# EAGLE design version1_4 (EAGLE 6.1)

## Sheet 1 of 2
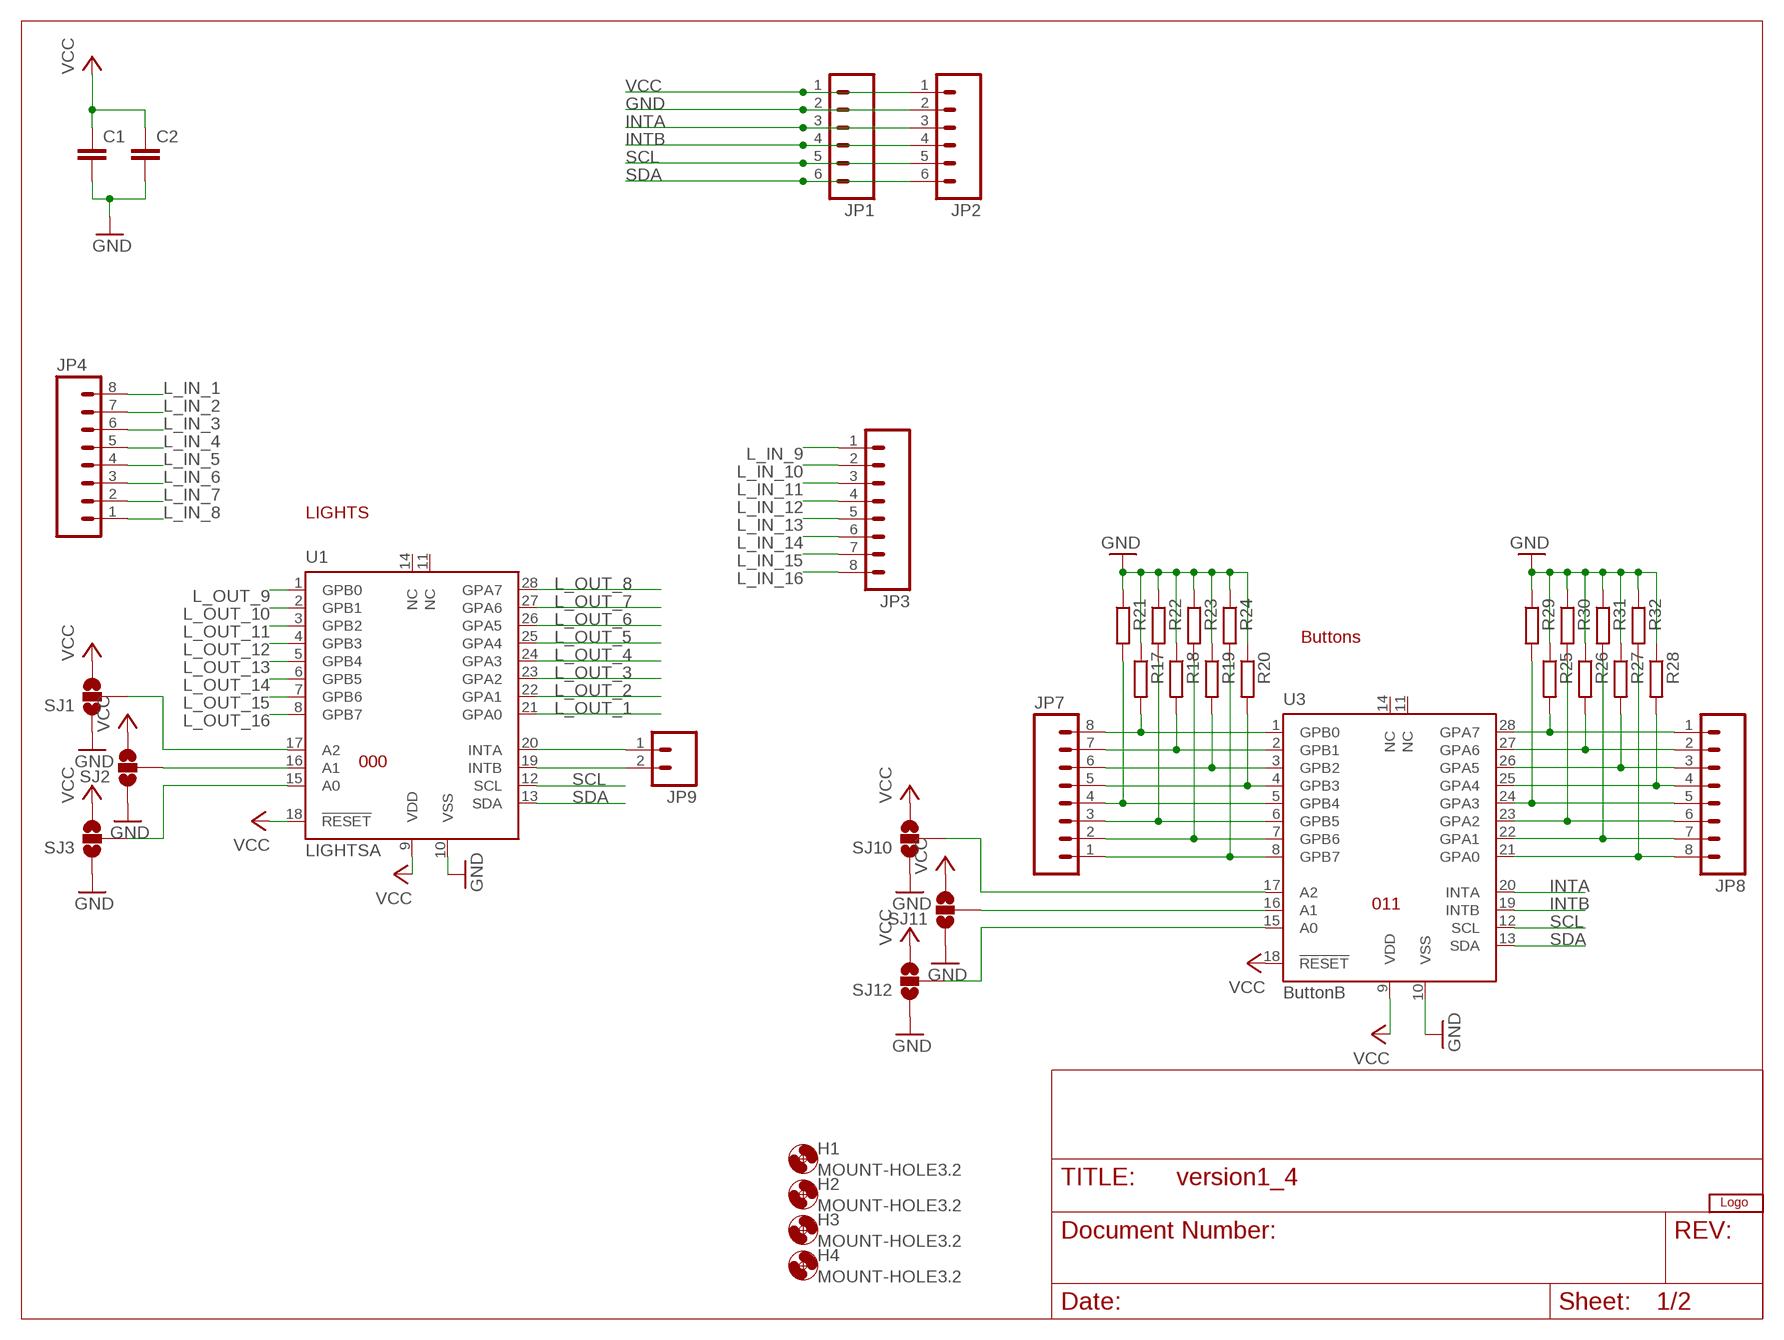
[diagram p0: schematic, sheet 1]

### Parts
C1  C-EUC0805  [C0805]
C2  C-EUC0805  [C0805]
H1  MOUNT-HOLE3.2  [3,2]
H2  MOUNT-HOLE3.2  [3,2]
H3  MOUNT-HOLE3.2  [3,2]
H4  MOUNT-HOLE3.2  [3,2]
JP1  M06LOCK  [1X06_LOCK]
JP2  M06LOCK  [1X06_LOCK]
JP3  M08LOCK  [1X08_LOCK]
JP4  M08LOCK  [1X08_LOCK]
JP7  M08LOCK  [1X08_LOCK]
JP8  M08LOCK  [1X08_LOCK]
JP9  M021X02_NO_SILK  [1X02_NO_SILK]
R17  R-EU_R0805  [R0805]
R18  R-EU_R0805  [R0805]
R19  R-EU_R0805  [R0805]
R20  R-EU_R0805  [R0805]
R21  R-EU_R0805  [R0805]
R22  R-EU_R0805  [R0805]
R23  R-EU_R0805  [R0805]
R24  R-EU_R0805  [R0805]
R25  R-EU_R0805  [R0805]
R26  R-EU_R0805  [R0805]
R27  R-EU_R0805  [R0805]
R28  R-EU_R0805  [R0805]
R29  R-EU_R0805  [R0805]
R30  R-EU_R0805  [R0805]
R31  R-EU_R0805  [R0805]
R32  R-EU_R0805  [R0805]
SJ1  SOLDERJUMPER_2WAY-OLDS  [SJ_3]
SJ2  SOLDERJUMPER_2WAY-OLDS  [SJ_3]
SJ3  SOLDERJUMPER_2WAY-OLDS  [SJ_3]
SJ10  SOLDERJUMPER_2WAY-OLDS  [SJ_3]
SJ11  SOLDERJUMPER_2WAY-OLDS  [SJ_3]
SJ12  SOLDERJUMPER_2WAY-OLDS  [SJ_3]
U1  LIGHTSA  MCP23017A  [MCP23017A]
U3  ButtonB  MCP23017A  [MCP23017A]
U$1  BUNNYLOGOCALVIN2  [CALVIN2]

### Nets
GND: C1.2 C2.2 JP1.2 JP2.2 R17.1 R18.1 R19.1 R20.1 R21.1 R22.1 R23.1 R24.1 R25.1 R26.1 R27.1 R28.1 R29.1 R30.1 R31.1 R32.1 SJ1.1 SJ2.1 SJ3.1 SJ10.1 SJ11.1 SJ12.1 U1.10(VSS) U3.10(VSS) ; also sheet 2
INTA: JP1.3 JP2.3 U3.20(INTA)
INTB: JP1.4 JP2.4 U3.19(INTB)
L_IN_1: JP4.8 ; also sheet 2
L_IN_2: JP4.7 ; also sheet 2
L_IN_3: JP4.6 ; also sheet 2
L_IN_4: JP4.5 ; also sheet 2
L_IN_5: JP4.4 ; also sheet 2
L_IN_6: JP4.3 ; also sheet 2
L_IN_7: JP4.2 ; also sheet 2
L_IN_8: JP4.1 ; also sheet 2
L_IN_9: JP3.1 ; also sheet 2
L_IN_10: JP3.2 ; also sheet 2
L_IN_11: JP3.3 ; also sheet 2
L_IN_12: JP3.4 ; also sheet 2
L_IN_13: JP3.5 ; also sheet 2
L_IN_14: JP3.6 ; also sheet 2
L_IN_15: JP3.7 ; also sheet 2
L_IN_16: JP3.8 ; also sheet 2
L_OUT_1: U1.21(GPA0) ; also sheet 2
L_OUT_2: U1.22(GPA1) ; also sheet 2
L_OUT_3: U1.23(GPA2) ; also sheet 2
L_OUT_4: U1.24(GPA3) ; also sheet 2
L_OUT_5: U1.25(GPA4) ; also sheet 2
L_OUT_6: U1.26(GPA5) ; also sheet 2
L_OUT_7: U1.27(GPA6) ; also sheet 2
L_OUT_8: U1.28(GPA7) ; also sheet 2
L_OUT_9: U1.1(GPB0) ; also sheet 2
L_OUT_10: U1.2(GPB1) ; also sheet 2
L_OUT_11: U1.3(GPB2) ; also sheet 2
L_OUT_12: U1.4(GPB3) ; also sheet 2
L_OUT_13: U1.5(GPB4) ; also sheet 2
L_OUT_14: U1.6(GPB5) ; also sheet 2
L_OUT_15: U1.7(GPB6) ; also sheet 2
L_OUT_16: U1.8(GPB7) ; also sheet 2
N$49: JP7.1 R24.2 U3.8(GPB7)
N$50: JP7.2 R23.2 U3.7(GPB6)
N$51: JP7.3 R22.2 U3.6(GPB5)
N$52: JP7.4 R21.2 U3.5(GPB4)
N$53: JP7.5 R20.2 U3.4(GPB3)
N$54: JP7.6 R19.2 U3.3(GPB2)
N$55: JP7.7 R18.2 U3.2(GPB1)
N$56: JP7.8 R17.2 U3.1(GPB0)
N$57: JP8.1 R25.2 U3.28(GPA7)
N$58: JP8.2 R26.2 U3.27(GPA6)
N$59: JP8.3 R27.2 U3.26(GPA5)
N$60: JP8.4 R28.2 U3.25(GPA4)
N$61: JP8.5 R29.2 U3.24(GPA3)
N$62: JP8.6 R30.2 U3.23(GPA2)
N$63: JP8.7 R31.2 U3.22(GPA1)
N$64: JP8.8 R32.2 U3.21(GPA0)
N$69: JP9.1 U1.20(INTA)
N$70: JP9.2 U1.19(INTB)
N$74: SJ10.2 U3.17(A2)
N$75: SJ11.2 U3.16(A1)
N$76: SJ12.2 U3.15(A0)
N$77: SJ2.2 U1.16(A1)
N$78: SJ3.2 U1.15(A0)
N$79: SJ1.2 U1.17(A2)
SCL: JP1.5 JP2.5 U1.12(SCL) U3.12(SCL)
SDA: JP1.6 JP2.6 U1.13(SDA) U3.13(SDA)
VCC [power]: C1.1 C2.1 JP1.1 JP2.1 SJ1.3 SJ2.3 SJ3.3 SJ10.3 SJ11.3 SJ12.3 U1.9(VDD) U1.18(!RESET) U3.9(VDD) U3.18(!RESET)
Unconnected: U1.11(NC) U1.14(NC) U3.11(NC) U3.14(NC)

### Notes on the sheet
- LIGHTS
- Buttons
- 000
- 011

## Sheet 2 of 2
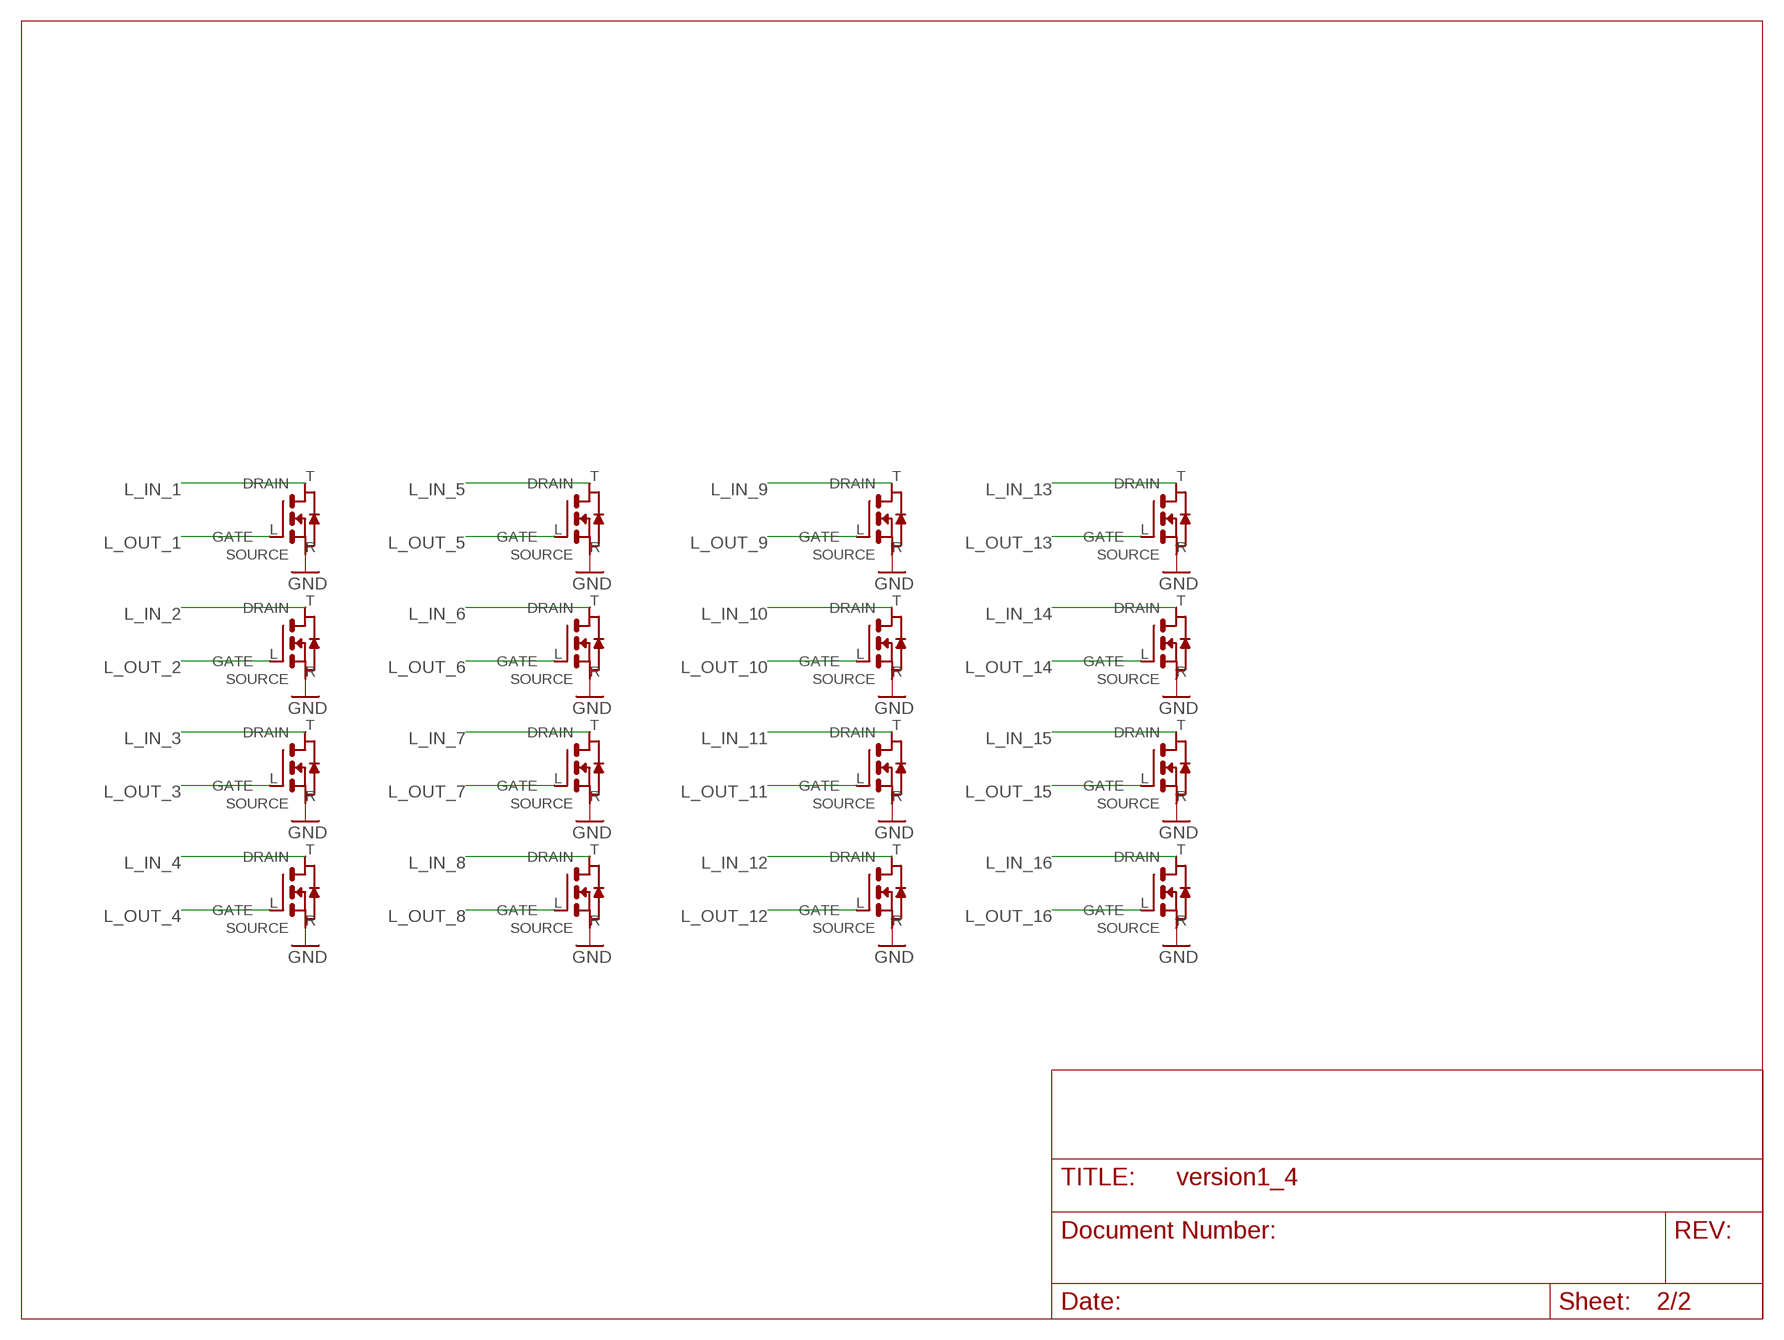
[diagram p1: schematic, sheet 2]

### Parts
Q1  DMG2302U  [SOT23-3A]
Q2  DMG2302U  [SOT23-3A]
Q3  DMG2302U  [SOT23-3A]
Q4  DMG2302U  [SOT23-3A]
Q5  DMG2302U  [SOT23-3A]
Q6  DMG2302U  [SOT23-3A]
Q7  DMG2302U  [SOT23-3A]
Q8  DMG2302U  [SOT23-3A]
Q9  DMG2302U  [SOT23-3A]
Q10  DMG2302U  [SOT23-3A]
Q11  DMG2302U  [SOT23-3A]
Q12  DMG2302U  [SOT23-3A]
Q13  DMG2302U  [SOT23-3A]
Q14  DMG2302U  [SOT23-3A]
Q15  DMG2302U  [SOT23-3A]
Q16  DMG2302U  [SOT23-3A]

### Nets
GND: Q1.R(SOURCE) Q2.R(SOURCE) Q3.R(SOURCE) Q4.R(SOURCE) Q5.R(SOURCE) Q6.R(SOURCE) Q7.R(SOURCE) Q8.R(SOURCE) Q9.R(SOURCE) Q10.R(SOURCE) Q11.R(SOURCE) Q12.R(SOURCE) Q13.R(SOURCE) Q14.R(SOURCE) Q15.R(SOURCE) Q16.R(SOURCE) ; also sheet 1
L_IN_1: Q2.T(DRAIN) ; also sheet 1
L_IN_2: Q1.T(DRAIN) ; also sheet 1
L_IN_3: Q3.T(DRAIN) ; also sheet 1
L_IN_4: Q4.T(DRAIN) ; also sheet 1
L_IN_5: Q5.T(DRAIN) ; also sheet 1
L_IN_6: Q6.T(DRAIN) ; also sheet 1
L_IN_7: Q7.T(DRAIN) ; also sheet 1
L_IN_8: Q8.T(DRAIN) ; also sheet 1
L_IN_9: Q9.T(DRAIN) ; also sheet 1
L_IN_10: Q10.T(DRAIN) ; also sheet 1
L_IN_11: Q11.T(DRAIN) ; also sheet 1
L_IN_12: Q12.T(DRAIN) ; also sheet 1
L_IN_13: Q13.T(DRAIN) ; also sheet 1
L_IN_14: Q14.T(DRAIN) ; also sheet 1
L_IN_15: Q15.T(DRAIN) ; also sheet 1
L_IN_16: Q16.T(DRAIN) ; also sheet 1
L_OUT_1: Q2.L(GATE) ; also sheet 1
L_OUT_2: Q1.L(GATE) ; also sheet 1
L_OUT_3: Q3.L(GATE) ; also sheet 1
L_OUT_4: Q4.L(GATE) ; also sheet 1
L_OUT_5: Q5.L(GATE) ; also sheet 1
L_OUT_6: Q6.L(GATE) ; also sheet 1
L_OUT_7: Q7.L(GATE) ; also sheet 1
L_OUT_8: Q8.L(GATE) ; also sheet 1
L_OUT_9: Q9.L(GATE) ; also sheet 1
L_OUT_10: Q10.L(GATE) ; also sheet 1
L_OUT_11: Q11.L(GATE) ; also sheet 1
L_OUT_12: Q12.L(GATE) ; also sheet 1
L_OUT_13: Q13.L(GATE) ; also sheet 1
L_OUT_14: Q14.L(GATE) ; also sheet 1
L_OUT_15: Q15.L(GATE) ; also sheet 1
L_OUT_16: Q16.L(GATE) ; also sheet 1

## Library data of the parts
C1 C2 = rcl:C-EU: CAPACITOR, European symbol
H1-H4 = holes:MOUNT-HOLE: MOUNTING HOLE with drill center marker
JP1 JP2 = SparkFun:M06: Header 6 Standard 6-pin 0.1" header. Use with straight break away headers (SKU : PRT-00116), right angle break away headers (PRT-00553), swiss pins (PRT-00743), machine pins (PRT-00117), and female headers (PRT-00115). Molex polarized connector foot print use with SKU : PRT-08094 with associated crimp pins and housings. NOTES ON THE VARIANTS LOCK and LOCK_LONGPADS... This footprint was designed to help hold the alignment of a through-hole component (i.e. 6-pin header) while soldering it into place. You may notice that each hole has been shifted either up or down by 0.005 of an inch from it's more standard position (which is a perfectly straight line). This slight alteration caused the pins (the squares in the middle) to touch the edges of the holes. Because they are alternating, it causes a "brace" to hold the component in place. 0.005 has proven to be the perfect amount of "off-center" position when using our standard breakaway headers. Although looks a little odd when you look at the bare footprint, once you have a header in there, the alteration is very hard to notice. Also, if you push a header all the way into place, it is covered up entirely on the bottom side. This idea of altering the position of holes to aid alignment will be further integrated into the Sparkfun Library for other footprints. It can help hold any component with 3 or more connection pins.
JP3 JP4 JP7 JP8 = SparkFun:M08: Header 8 Standard 8-pin 0.1" header. Use with straight break away headers (SKU : PRT-00116), right angle break away headers (PRT-00553), swiss pins (PRT-00743), machine pins (PRT-00117), and female headers (PRT-00115).
JP9 = SparkFun:M02: Header 2 Standard 2-pin 0.1" header. Use with straight break away headers (SKU : PRT-00116), right angle break away headers (PRT-00553), swiss pins (PRT-00743), machine pins (PRT-00117), and female headers (PRT-00115). Molex polarized connector foot print use with SKU : PRT-08233 with associated crimp pins and housings.
Q1-Q16 = brv_v6_2:DMG2302U
R17-R32 = rcl:R-EU_: RESISTOR, European symbol
SJ1-SJ3 SJ10-SJ12 = SparkFun:SOLDERJUMPER_2WAY-OLD: Solder Jumper 2 way solder jumper
U1 U3 = brv_v6_2:MCP23017A: edit this description Auto generated by make-symbol-device-package-bsdl.ulp Rev. 43 Source:
U$1 = brv_v6_2:BUNNYLOGO

## Net classes
0 default: width 0.203 mm, drill 0.305 mm, clearance 0.203 mm
1 power: width 0.203 mm, drill 0.305 mm, clearance 0.203 mm

## Board
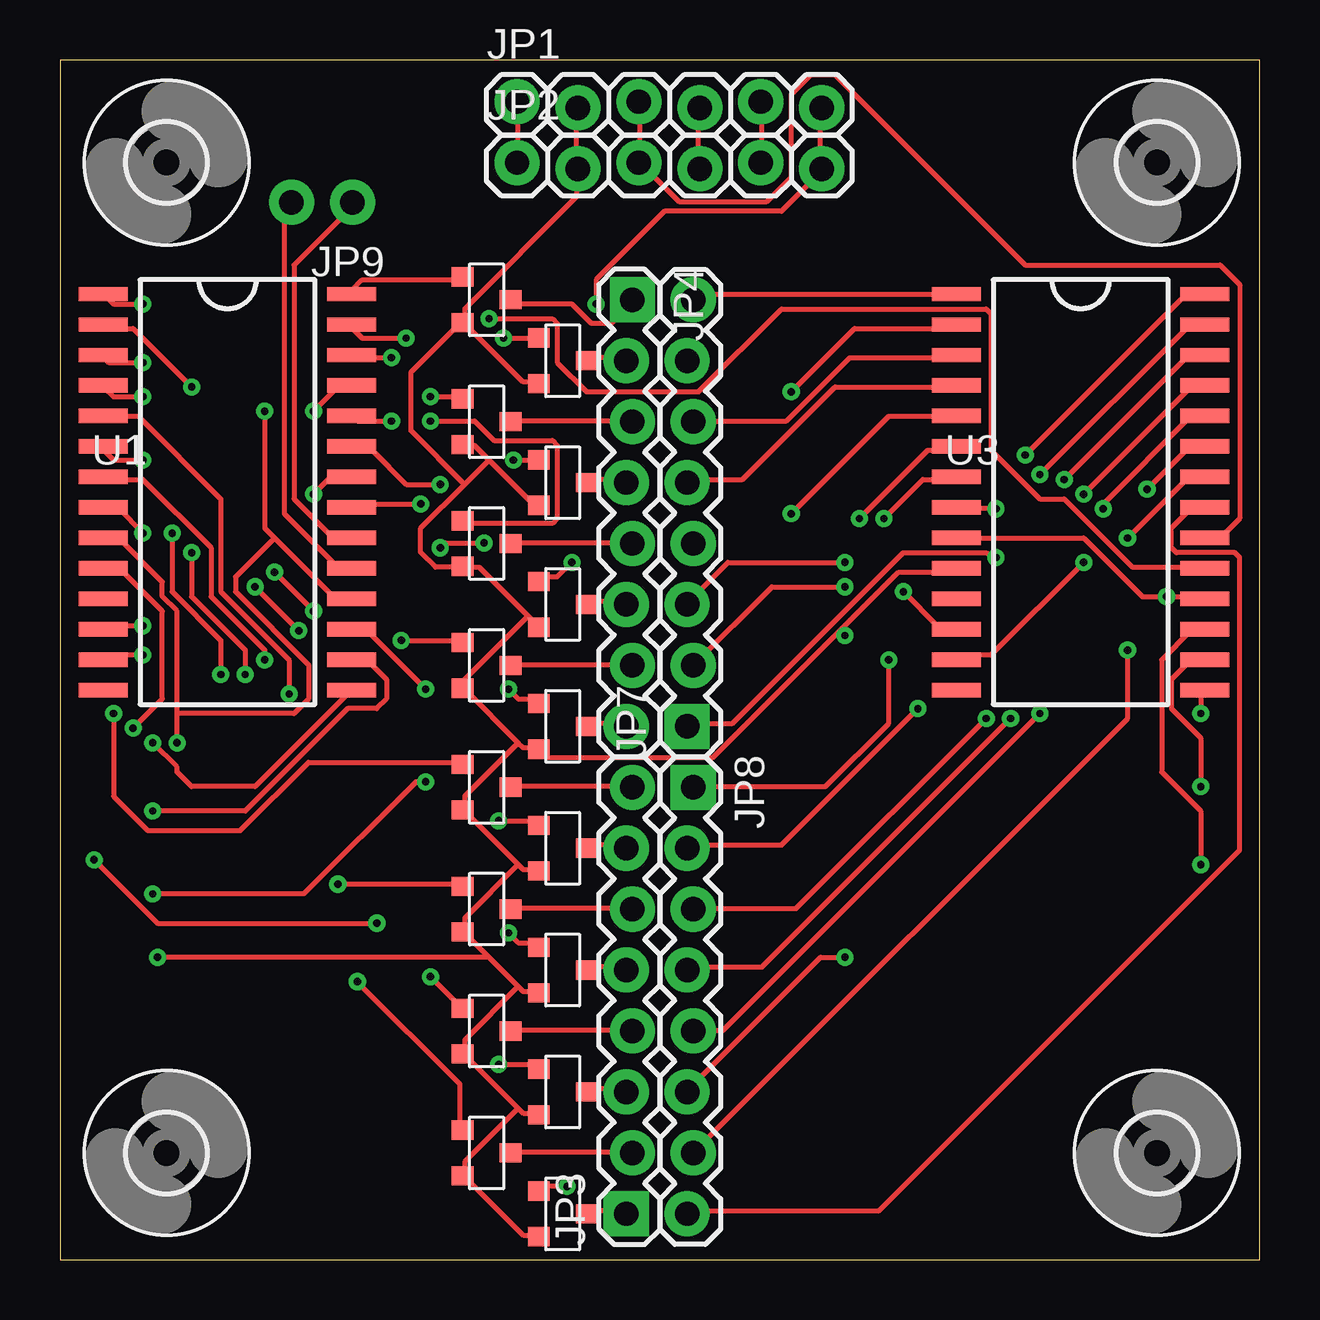
[diagram p2: board, top side]
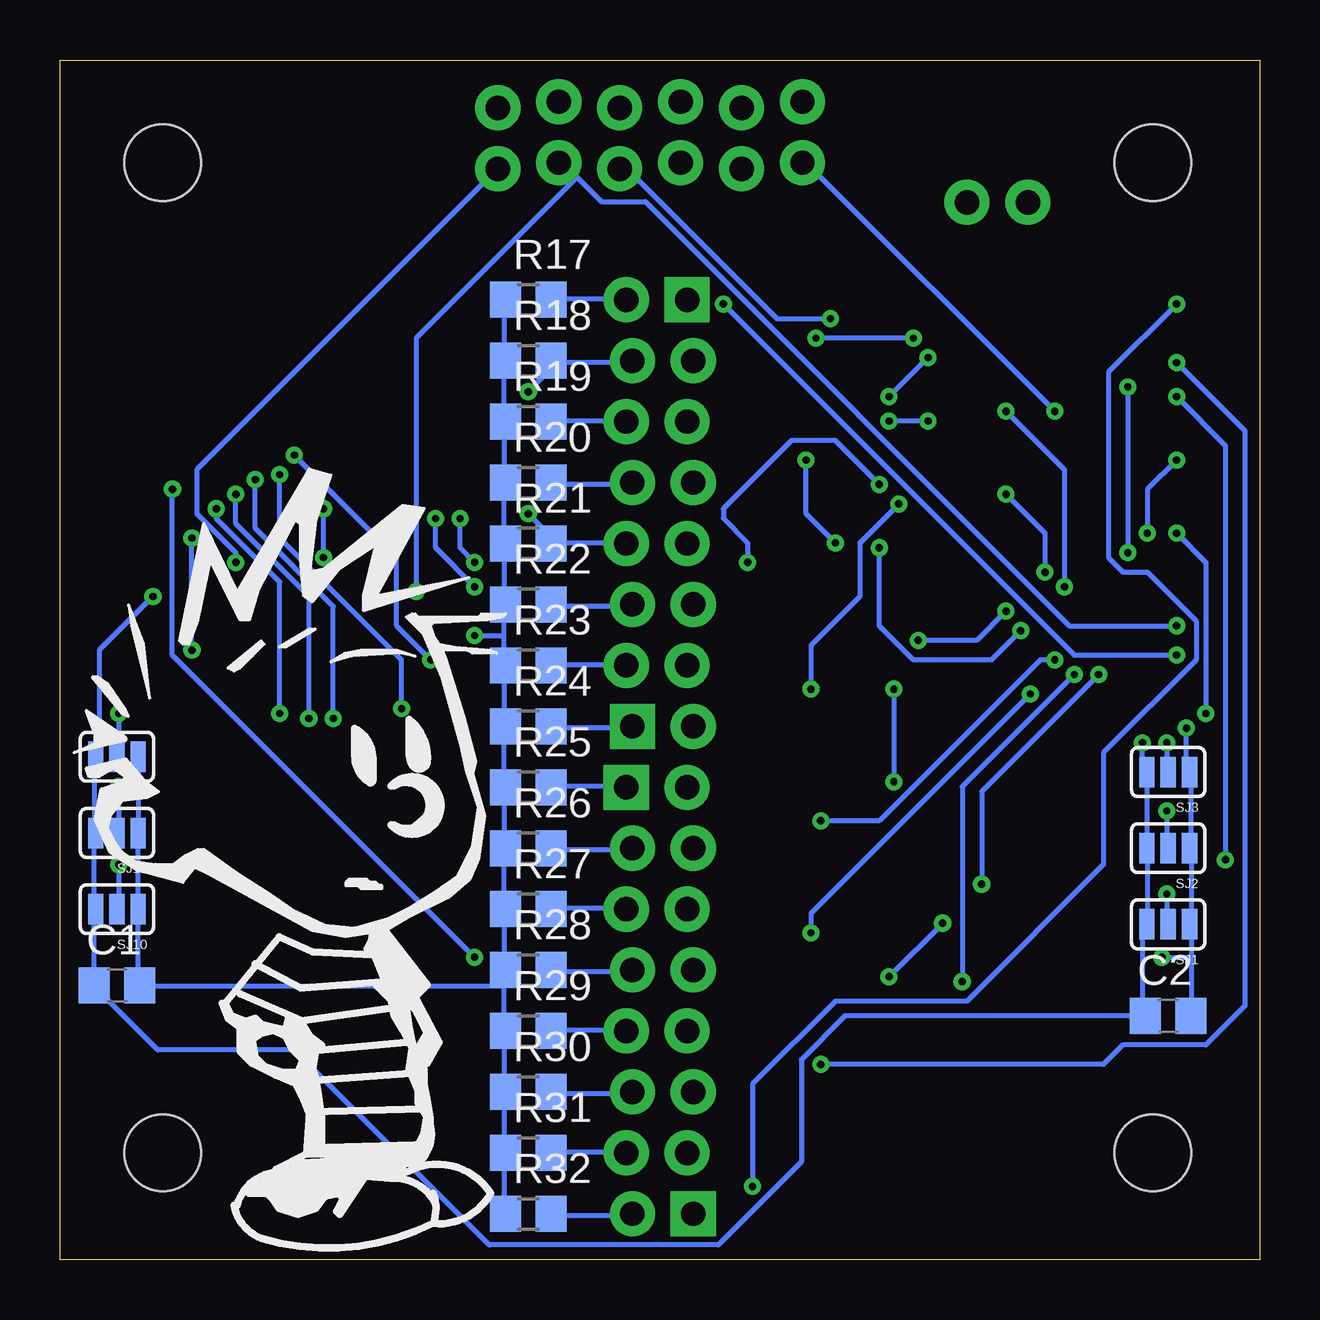
[diagram p3: board, bottom side, seen from below]

Size 50 x 50 mm. Coordinates in mm from the lower left corner, seen from the top.
Outline: 50,0 50,50 0,50 0,0 50,0
Copper layers (1*16): Top 0.035mm / dielectric 1.5mm / Bottom 0.035mm
Design rules: minimum track width 8mil, minimum drill 12mil, track to track 8mil, track to pad 8mil, pad to pad 8mil, via to via 8mil, smd to smd 8mil, copper to edge 20mil, drill to drill 8mil, minimum pad ring 10mil, minimum via ring 8mil, stop-mask expansion 4mil, vias tented up to drill 0mil, thermal gap 10mil

### Footprints (pad centres in the part's own frame; a part is rotated, then mirrored left to right if it is on the bottom)
C0805 = smd 1.3 x 1.5: 1 -0.95,0; 2 0.95,0
3,2 = hole 3.2: 0,0
1X06_LOCK = drill 1.016 pad 1.88: 1 0,0; 2 2.54,-0.254; 3 5.08,0; 4 7.62,-0.254; 5 10.16,0; 6 12.7,-0.254
1X08_LOCK = drill 1.016 pad 1.88 square: 1 0,0.127 | drill 1.016 pad 1.88: 2 2.54,-0.127; 3 5.08,0.127; 4 7.62,-0.127; 5 10.16,0.127; 6 12.7,-0.127; 7 15.24,0.127; 8 17.78,-0.127
1X02_NO_SILK = drill 1.016 pad 1.88: 1 0,0; 2 2.54,0
SOT23-3A = smd 0.8 x 0.9: L -0.95,-1; R 0.95,-1; T 0,1
R0805 = smd 1.3 x 1.5: 1 -0.95,0; 2 0.95,0
SJ_3 = smd 0.635 x 1.27: 1 -0.889,0; 2 0,0; 3 0.889,0
MCP23017A = smd 2.05 x 0.6: 1 -5.177,8.255; 2 -5.177,6.985; 3 -5.177,5.715; 4 -5.177,4.445; 5 -5.177,3.175; 6 -5.177,1.905; 7 -5.177,0.635; 8 -5.177,-0.635; 9 -5.177,-1.905; 10 -5.177,-3.175; 11 -5.177,-4.445; 12 -5.177,-5.715; 13 -5.177,-6.985; 14 -5.177,-8.255; 15 5.177,-8.255; 16 5.177,-6.985; 17 5.177,-5.715; 18 5.177,-4.445; 19 5.177,-3.175; 20 5.177,-1.905; 21 5.177,-0.635; 22 5.177,0.635; 23 5.177,1.905; 24 5.177,3.175; 25 5.177,4.445; 26 5.177,5.715; 27 5.177,6.985; 28 5.177,8.255

### Placement (x,y rotation side)
C1  47.62,11.43 0 bottom
C2  3.81,10.16 0 bottom
H1  45.72,4.45 0 top
H2  45.72,45.72 0 top
H3  4.45,45.72 0 top
H4  4.45,4.45 0 top
JP1  19.05,48.26 0 top
JP2  19.05,45.72 0 top
JP3  23.73,1.91 90 top
JP4  23.73,40.01 270 top
JP7  26.27,22.23 90 top
JP8  26.27,19.68 270 top
JP9  12.19,44.07 180 top
Q1  17.78,24.77 270 top
Q2  20.95,22.23 270 top
Q3  20.95,27.3 270 top
Q4  17.78,29.84 270 top
Q5  20.95,32.38 270 top
Q6  17.78,34.92 270 top
Q7  20.95,37.47 270 top
Q8  17.78,40.01 270 top
Q9  20.95,1.91 270 top
Q10  17.78,4.45 270 top
Q11  20.95,6.99 270 top
Q12  17.78,9.53 270 top
Q13  20.95,12.06 270 top
Q14  17.78,14.61 270 top
Q15  20.95,17.14 270 top
Q16  17.78,19.68 270 top
R17  30.48,40.01 0 bottom
R18  30.48,37.47 0 bottom
R19  30.48,34.92 0 bottom
R20  30.48,32.38 0 bottom
R21  30.48,29.84 0 bottom
R22  30.48,27.3 0 bottom
R23  30.48,24.77 0 bottom
R24  30.48,22.23 0 bottom
R25  30.48,19.68 0 bottom
R26  30.48,17.14 0 bottom
R27  30.48,14.61 0 bottom
R28  30.48,12.06 0 bottom
R29  30.48,9.53 0 bottom
R30  30.48,6.99 0 bottom
R31  30.48,4.45 0 bottom
R32  30.48,1.91 0 bottom
SJ1  3.81,13.97 180 bottom
SJ2  3.81,17.14 180 bottom
SJ3  3.81,20.32 180 bottom
SJ10  47.62,14.61 180 bottom
SJ11  47.62,17.78 180 bottom
SJ12  47.62,20.95 180 bottom
U1  6.99,31.98 0 top
U3  42.55,31.98 0 top
U$1  50.04,-0.51 0 bottom

### Tracks (layer width: path | path; a pad name or v marks a point on that pad's centre or on a via)
GND  (via drill 0.3)
  Top 0.203: v3.05,22.15 4.27,23.37 4.27,27.03 2.64,28.65 1.83,28.65 U1.10 | Q9.R 19.91,1.02 19.3,1.02 16.87,3.45 Q10.R 16.87,3.66 16.87,4.06 19.1,6.3 | 19.1,6.3 16.87,8.53 Q12.R 16.87,8.74 16.87,9.14 19.1,11.38 | 19.1,6.3 19.3,6.1 19.91,6.1 Q11.R | 17.88,12.6 16.87,13.61 Q14.R 16.87,13.82 16.87,14.22 19.1,16.46 | 17.88,12.6 19.1,11.38 | 19.1,11.38 19.3,11.18 19.91,11.18 Q13.R | 19.1,16.46 16.87,18.69 Q16.R 16.87,18.9 16.87,19.3 19.1,21.54 | 19.1,16.46 19.3,16.26 19.91,16.26 Q15.R | Q8.R 16.87,39.01 19.3,36.58 19.91,36.58 Q7.R | Q8.R 16.87,39.22 16.87,39.62 21.54,44.3 21.54,45.31 JP2.2 21.54,45.52 21.54,47.95 JP1.2 | 17.88,33.33 19.91,31.29 Q5.R | 17.88,33.33 17.27,33.93 16.87,33.93 Q6.R | 19.51,26.82 17.48,28.85 16.87,28.85 Q4.R 16.66,28.85 15.65,28.85 15.04,29.46 15.04,30.48 16.87,32.31 | 19.51,26.82 19.91,26.42 Q3.R | 19.1,21.54 16.87,23.77 Q1.R 16.66,23.98 19.51,26.82 | 19.1,21.54 19.3,21.34 19.91,21.34 Q2.R 20.12,21.13 20.32,20.93 27.23,20.93 32.51,26.21 | 32.51,26.21 34.95,28.65 37.19,28.65 U3.10 | 16.87,32.31 17.88,33.33 | 16.87,32.31 14.63,34.54 14.63,36.98 16.66,39.01 Q8.R | 17.88,12.6 v4.06,12.6 | 32.51,26.21 v32.72,26.01
  Bottom 0.203: SJ12.1 46.74,20.93 46.74,17.88 SJ11.1 46.74,17.68 46.74,14.63 SJ10.1 46.74,14.43 46.74,11.58 C1.2 46.53,11.38 31.5,11.38 | R17.1 31.5,39.83 31.5,37.59 R18.1 31.5,37.39 31.5,34.95 R19.1 31.5,34.75 31.5,32.51 R20.1 31.5,32.31 31.5,29.87 R21.1 31.5,29.67 31.5,27.43 R22.1 31.5,27.23 31.5,26.01 | R28.1 31.5,12.19 31.5,14.43 R27.1 31.5,14.63 31.5,17.07 R26.1 31.5,17.27 31.5,19.51 R25.1 31.5,19.71 31.5,22.15 R24.1 31.5,22.35 31.5,24.59 R23.1 31.5,24.79 31.5,26.01 | R32.1 31.5,2.03 31.5,4.27 R31.1 31.5,4.47 31.5,6.91 R30.1 31.5,7.11 31.5,9.35 R29.1 31.5,9.55 31.5,11.38 | 31.5,11.38 31.5,11.99 R28.1 | 31.5,11.38 R28.1 | 2.85,12.6 2.85,13.82 SJ1.1 2.85,14.02 2.85,17.07 SJ2.1 2.85,17.27 2.85,20.32 SJ3.1 3.05,20.32 v3.05,22.15 | 2.85,12.6 2.85,10.16 C2.2 | v4.06,12.6 2.85,12.6 | v32.72,26.01 31.5,26.01
INTA
  Top 0.203: 24.18,45.72 25.81,44.09 29.46,44.09 30.48,45.11 30.48,48.56 31.29,49.38 32.31,49.38 40.23,41.45 48.36,41.45 49.17,40.64 49.17,30.89 48.56,30.28 47.75,30.28 U3.20 | 24.18,45.72 JP2.3 24.18,45.72 | 24.18,45.72 24.18,48.16 JP1.3
INTB  (via drill 0.3)
  Top 0.203: v17.88,39.22 20.52,39.22 20.73,39.01 20.73,37.39 21.95,36.17 26.62,36.17 30.07,39.62 38.61,39.62 38.81,39.42 38.81,33.73 40.84,31.7 41.86,31.7 44.7,28.85 47.55,28.85 U3.19 | JP1.4 26.62,47.95 26.62,45.52 JP2.4
  Bottom 0.203: v17.88,39.22 20.12,39.22 26.21,45.31 26.62,45.31 JP2.4
L_IN_1
  Top 0.203: Q2.T 22.15,22.35 23.57,22.35 JP4.8
L_IN_2
  Top 0.203: Q1.T 18.9,24.79 23.77,24.79 JP4.7
L_IN_3
  Top 0.203: Q3.T 22.15,27.43 23.57,27.43 JP4.6
L_IN_4
  Top 0.203: Q4.T 18.9,29.87 23.77,29.87 JP4.5
L_IN_5
  Top 0.203: Q5.T 22.15,32.51 23.57,32.51 JP4.4
L_IN_6
  Top 0.203: Q6.T 18.9,34.95 23.77,34.95 JP4.3
L_IN_7
  Top 0.203: Q7.T 22.15,37.59 23.57,37.59 JP4.2
L_IN_8
  Top 0.203: Q8.T 18.9,39.83 21.34,39.83 22.15,39.01 22.96,39.01 23.77,39.83 JP4.1
L_IN_9
  Top 0.203: Q9.T 22.15,2.03 23.57,2.03 JP3.1
L_IN_10
  Top 0.203: Q10.T 18.9,4.47 23.77,4.47 JP3.2
L_IN_11
  Top 0.203: Q11.T 22.15,7.11 23.57,7.11 JP3.3
L_IN_12
  Top 0.203: Q12.T 18.9,9.55 23.77,9.55 JP3.4
L_IN_13
  Top 0.203: Q13.T 22.15,12.19 23.57,12.19 JP3.5
L_IN_14
  Top 0.203: Q14.T 18.9,14.63 23.77,14.63 JP3.6
L_IN_15
  Top 0.203: Q15.T 22.15,17.27 23.57,17.27 JP3.7
L_IN_16
  Top 0.203: Q16.T 18.9,19.71 23.77,19.71 JP3.8
L_OUT_1  (via drill 0.3)
  Top 0.203: v18.69,23.77 19.1,23.37 19.91,23.37 Q2.L | v15.04,31.5 12.19,31.5 U1.21
  Bottom 0.203: v18.69,23.77 18.69,25.6 16.66,27.64 16.66,29.87 v15.04,31.5
L_OUT_2  (via drill 0.3)
  Top 0.203: v14.22,25.81 16.66,25.81 Q1.L | v8.94,28.65 v10.57,27.03 | v10.57,31.9 11.18,32.51 11.99,32.51 U1.22
  Bottom 0.203: v14.22,25.81 11.79,25.81 v10.57,27.03 | v8.94,28.65 8.94,30.28 v10.57,31.9
L_OUT_3  (via drill 0.3)
  Top 0.203: v21.34,29.06 20.73,28.45 20.12,28.45 Q3.L | v15.85,32.31 14.43,32.31 13.01,33.73 12.19,33.73 U1.23
  Bottom 0.203: v21.34,29.06 21.34,29.87 22.35,30.89 22.35,31.29 19.51,34.14 17.68,34.14 v15.85,32.31
L_OUT_4  (via drill 0.3)
  Top 0.203: v15.44,34.95 17.27,34.95 18.09,34.14 20.52,34.14 20.73,33.93 20.73,30.89 20.52,30.68 16.87,30.68 Q4.L | v13.82,34.95 12.39,34.95 12.19,35.15 U1.24
  Bottom 0.203: v13.82,34.95 v15.44,34.95
L_OUT_5  (via drill 0.3)
  Top 0.203: v18.9,33.33 19.91,33.33 Q5.L | v17.68,29.87 16.05,29.87 v15.85,29.67 | v8.13,28.04 v9.96,26.21 | v10.57,35.36 11.58,36.37 11.99,36.37 U1.25
  Bottom 0.203: v18.9,33.33 18.9,31.09 v17.68,29.87 | v15.85,29.67 15.85,26.42 14.43,24.99 11.18,24.99 v9.96,26.21 | v8.13,28.04 8.13,32.92 v10.57,35.36
L_OUT_6  (via drill 0.3)
  Top 0.203: v15.44,35.97 16.66,35.97 Q6.L | v13.82,37.59 12.19,37.59 U1.26
  Bottom 0.203: v13.82,37.59 v15.44,35.97
L_OUT_7  (via drill 0.3)
  Top 0.203: v18.49,38.41 19.91,38.41 Q7.L | v14.43,38.41 12.6,38.41 12.19,38.81 U1.27
  Bottom 0.203: v14.43,38.41 v18.49,38.41
L_OUT_8
  Top 0.203: Q8.L 16.66,40.84 12.6,40.84 12.19,40.44 U1.28
L_OUT_9  (via drill 0.3)
  Top 0.203: v21.13,3.05 20.12,3.05 Q9.L | v3.45,39.83 2.23,39.83 1.83,40.23 U1.1
  Bottom 0.203: v21.13,3.05 21.13,7.32 17.68,10.77 12.19,10.77 6.5,16.46 6.5,21.13 2.64,24.99 2.64,26.62 4.67,28.65 5.69,28.65 6.3,29.26 6.3,36.98 v3.45,39.83
L_OUT_10  (via drill 0.3)
  Top 0.203: v12.39,11.58 16.66,7.32 16.66,5.49 Q10.L | v7.72,24.38 7.72,25.4 5.49,27.64 v5.49,29.46 | v5.49,36.37 3.05,38.81 1.83,38.81 U1.2
  Bottom 0.203: v12.39,11.58 12.39,19.71 v7.72,24.38 | v5.49,36.37 v5.49,29.46
L_OUT_11  (via drill 0.3)
  Top 0.203: v18.29,8.13 19.91,8.13 Q11.L | v3.45,37.39 2.03,37.39 1.83,37.59 U1.3
  Bottom 0.203: v18.29,8.13 6.5,8.13 5.69,8.94 2.23,8.94 0.61,10.57 0.61,34.54 v3.45,37.39
L_OUT_12  (via drill 0.3)
  Top 0.203: v15.44,11.79 16.66,10.57 Q12.L | v13.21,14.02 4.06,14.02 v1.42,16.66 | v3.45,35.97 2.23,35.97 1.83,36.37 U1.4
  Bottom 0.203: v13.21,14.02 v15.44,11.79 | v1.42,16.66 1.42,33.93 v3.45,35.97
L_OUT_13  (via drill 0.3)
  Top 0.203: v18.69,13.61 19.1,13.21 19.91,13.21 Q13.L | v9.55,23.57 9.55,24.99 6.71,27.84 6.71,31.7 3.25,35.15 1.83,35.15 U1.5
  Bottom 0.203: v18.69,13.61 18.69,14.43 v9.55,23.57
L_OUT_14  (via drill 0.3)
  Top 0.203: v11.58,15.65 16.66,15.65 Q14.L | v6.71,24.38 6.71,25.81 4.67,27.84 v4.67,30.28 | v3.45,33.33 2.23,33.33 1.83,33.73 U1.6
  Bottom 0.203: v11.58,15.65 11.58,19.51 v6.71,24.38 | v4.67,30.28 4.67,32.11 v3.45,33.33
L_OUT_15  (via drill 0.3)
  Top 0.203: v18.29,18.29 19.91,18.29 Q15.L | v8.53,24.99 8.53,25.4 6.3,27.64 6.3,29.67 3.45,32.51 1.83,32.51 U1.7
  Bottom 0.203: v18.29,18.29 15.85,18.29 9.14,24.99 v8.53,24.99
L_OUT_16  (via drill 0.3)
  Top 0.203: v2.23,22.76 2.23,19.3 3.66,17.88 7.52,17.88 10.36,20.73 16.66,20.73 Q16.L | v3.45,30.28 2.44,31.29 1.83,31.29 U1.8
  Bottom 0.203: v2.23,22.76 2.23,29.06 v3.45,30.28
N$49  (via drill 0.3)
  Top 0.203: v39.01,31.29 37.39,31.29 U3.8 | v39.01,29.26 38.81,29.26 38.61,29.46 35.15,29.46 28.04,22.35 26.21,22.35 JP7.1
  Bottom 0.203: R24.2 29.46,22.15 26.21,22.15 JP7.1 | v39.01,29.26 v39.01,31.29
N$50  (via drill 0.3)
  Top 0.203: v34.34,30.89 35.97,32.51 37.19,32.51 U3.7 | v32.72,28.04 29.67,28.04 26.42,24.79 JP7.2
  Bottom 0.203: R23.2 29.46,24.79 26.42,24.79 JP7.2 | v34.34,30.89 34.34,29.67 v32.72,28.04
N$51  (via drill 0.3)
  Top 0.203: v33.33,30.89 36.17,33.73 37.19,33.73 U3.6 | v32.72,29.06 27.84,29.06 26.21,27.43 JP7.3
  Bottom 0.203: R22.2 29.46,27.23 26.21,27.23 JP7.3 | v33.33,30.89 33.33,29.67 v32.72,29.06
N$52  (via drill 0.3)
  Top 0.203: v30.48,31.09 34.54,35.15 37.19,35.15 U3.5
  Bottom 0.203: 29.26,29.87 26.42,29.87 JP7.4 | 29.26,29.87 29.46,29.87 R21.2 29.26,29.87 | 29.26,29.87 v30.48,31.09
N$53
  Top 0.203: U3.4 37.19,36.37 32.31,36.37 28.45,32.51 26.21,32.51 JP7.5
  Bottom 0.203: R20.2 29.46,32.31 26.21,32.31 JP7.5
N$54
  Top 0.203: U3.3 37.19,37.59 32.92,37.59 30.28,34.95 26.42,34.95 JP7.6
  Bottom 0.203: R19.2 29.46,34.95 26.42,34.95 JP7.6
N$55  (via drill 0.3)
  Top 0.203: v30.48,36.17 33.12,38.81 37.19,38.81 U3.2
  Bottom 0.203: 29.26,37.39 26.21,37.39 JP7.7 | 29.26,37.39 29.46,37.39 R18.2 29.26,37.39 | 29.26,37.39 v30.48,36.17
N$56
  Top 0.203: U3.1 37.19,40.23 26.62,40.23 26.42,40.03 JP7.8
  Bottom 0.203: R17.2 29.46,40.03 26.42,40.03 JP7.8
N$57  (via drill 0.3)
  Top 0.203: v40.23,33.53 46.94,40.23 47.55,40.23 U3.28 | v34.54,24.99 34.54,22.35 31.9,19.71 26.42,19.71 JP8.1
  Bottom 0.203: R25.2 29.46,19.71 26.42,19.71 JP8.1 | v40.23,33.53 35.97,29.26 35.97,26.42 v34.54,24.99
N$58  (via drill 0.3)
  Top 0.203: v40.84,32.72 46.94,38.81 47.55,38.81 U3.27 | v35.76,22.96 30.07,17.27 26.21,17.27 JP8.2
  Bottom 0.203: R26.2 29.46,17.07 26.21,17.07 JP8.2 | v40.84,32.72 40.84,30.07 35.76,24.99 v35.76,22.96
N$59  (via drill 0.3)
  Top 0.203: v41.86,32.51 46.94,37.59 47.55,37.59 U3.26 | v38.61,22.55 30.68,14.63 26.42,14.63 JP8.3
  Bottom 0.203: R27.2 29.46,14.63 26.42,14.63 JP8.3 | v41.86,32.51 41.86,30.48 38.61,27.23 v38.61,22.55
N$60  (via drill 0.3)
  Top 0.203: v42.67,31.9 47.14,36.37 47.55,36.37 U3.25 | v39.62,22.55 29.26,12.19 26.21,12.19 JP8.4
  Bottom 0.203: R28.2 29.46,11.99 26.21,11.99 JP8.4 | v42.67,31.9 42.67,30.68 39.62,27.64 v39.62,22.55
N$61  (via drill 0.3)
  Top 0.203: v43.48,31.29 43.48,31.5 47.14,35.15 47.55,35.15 U3.24 | v40.84,22.76 27.64,9.55 26.42,9.55 JP8.5
  Bottom 0.203: R29.2 29.46,9.55 26.42,9.55 JP8.5 | v43.48,31.29 43.48,30.89 40.84,28.25 v40.84,22.76
N$62  (via drill 0.3)
  Top 0.203: v45.31,32.11 46.94,33.73 47.55,33.73 U3.23 | v32.72,12.6 31.7,12.6 26.21,7.11 JP8.6
  Bottom 0.203: R30.2 29.46,6.91 26.21,6.91 JP8.6 | v45.31,32.11 45.31,25.2 v32.72,12.6
N$63  (via drill 0.3)
  Top 0.203: v44.5,30.07 46.94,32.51 47.55,32.51 U3.22 | v44.5,25.4 44.5,22.55 26.42,4.47 JP8.7
  Bottom 0.203: R31.2 29.46,4.47 26.42,4.47 JP8.7 | v44.5,25.4 v44.5,30.07
N$64
  Top 0.203: U3.21 47.55,31.29 47.14,31.29 46.33,30.48 46.33,29.67 46.53,29.46 48.97,29.46 49.17,29.26 49.17,17.07 34.14,2.03 26.21,2.03 JP8.8
  Bottom 0.203: R32.2 29.46,1.83 26.21,1.83 JP8.8
N$69
  Top 0.203: U1.20 11.99,30.28 11.18,30.28 9.75,31.7 9.75,41.45 12.19,43.89 JP9.1
N$70
  Top 0.203: U1.19 11.99,28.85 11.58,28.85 9.35,31.09 9.35,43.69 9.55,43.89 JP9.2
N$74  (via drill 0.3)
  Top 0.203: v47.55,16.46 47.55,18.69 45.92,20.32 45.92,24.99 47.14,26.21 47.55,26.21 U3.17
  Bottom 0.203: v47.55,16.46 47.55,14.63 SJ10.2
N$75  (via drill 0.3)
  Top 0.203: v47.55,19.71 47.55,21.74 46.33,22.96 46.33,24.18 47.14,24.99 47.55,24.99 U3.16
  Bottom 0.203: v47.55,19.71 47.55,17.88 SJ11.2
N$76  (via drill 0.3)
  Top 0.203: v47.55,22.76 47.55,23.57 U3.15
  Bottom 0.203: v47.55,22.76 47.55,21.13 SJ12.2
N$77  (via drill 0.3)
  Top 0.203: v3.86,18.69 7.72,18.69 11.99,22.96 13.21,22.96 13.61,23.37 13.61,24.18 12.8,24.99 12.19,24.99 U1.16
  Bottom 0.203: v3.86,18.69 3.86,17.27 SJ2.2
N$78  (via drill 0.3)
  Top 0.203: v3.86,21.54 4.88,20.52 4.88,20.32 5.49,19.71 8.13,19.71 11.99,23.57 U1.15
  Bottom 0.203: v3.86,21.54 3.86,20.32 SJ3.2
N$79  (via drill 0.3)
  Top 0.203: v3.86,15.24 10.16,15.24 14.83,19.91 v15.24,19.91 | v15.24,23.77 12.8,26.21 12.19,26.21 U1.17
  Bottom 0.203: v3.86,15.24 3.86,14.02 SJ1.2 | v15.24,23.77 v15.24,19.91
SCL  (via drill 0.3)
  Top 0.203: v3.45,26.42 1.83,26.42 U1.12 | v35.15,27.84 36.58,26.42 37.19,26.42 U3.12 | JP1.5 29.26,48.16 29.26,45.72 JP2.5
  Bottom 0.203: v3.45,26.42 7.92,26.42 25.6,44.09 27.43,44.09 28.45,45.11 | 28.45,45.11 29.06,45.72 JP2.5 | v35.15,27.84 35.15,38.41 28.45,45.11
SDA  (via drill 0.3)
  Top 0.203: v3.45,25.2 1.83,25.2 U1.13 | v22.35,39.83 22.35,40.84 25.2,43.69 30.07,43.69 31.7,45.31 JP2.6 31.7,45.52 31.7,47.95 JP1.6 | v42.67,29.06 38.81,25.2 37.39,25.2 U3.13
  Bottom 0.203: v3.45,25.2 7.72,25.2 v22.35,39.83 | v42.67,29.06 42.67,29.46 44.3,31.09 44.3,32.92 31.9,45.31 JP2.6
VCC  (via drill 0.3)
  Top 0.203: U3.18 47.55,27.64 v46.13,27.64 45.11,27.64 42.67,30.07 37.39,30.07 U3.9 | v4.88,21.54 4.88,22.76 | 4.88,22.76 4.88,27.03 4.27,27.64 4.27,28.25 2.44,30.07 1.83,30.07 U1.9 | 8.94,30.07 8.53,30.48 v8.53,35.36 | 8.94,30.07 11.38,27.64 11.99,27.64 U1.18 | JP1.1 19.1,48.16 19.1,45.72 JP2.1 | 4.88,22.76 9.75,22.76 10.36,23.37 10.36,24.79 7.32,27.84 7.32,28.45 8.94,30.07
  Bottom 0.203: v46.13,27.64 48.36,25.4 48.36,21.13 SJ12.3 48.56,20.93 48.56,17.88 SJ11.3 48.56,17.68 48.56,14.63 SJ10.3 48.56,14.43 48.56,11.58 C1.1 48.56,11.38 45.92,8.74 40.23,8.74 32.11,0.61 22.55,0.61 19.1,4.06 19.1,8.33 17.27,10.16 4.88,10.16 | 4.88,10.16 4.88,13.82 SJ1.3 4.67,14.02 4.67,17.07 SJ2.3 4.67,17.27 4.67,20.32 SJ3.3 4.88,20.32 v4.88,21.54 | 4.88,10.16 C2.1 4.88,10.16 | v8.53,35.36 18.9,45.72 JP2.1